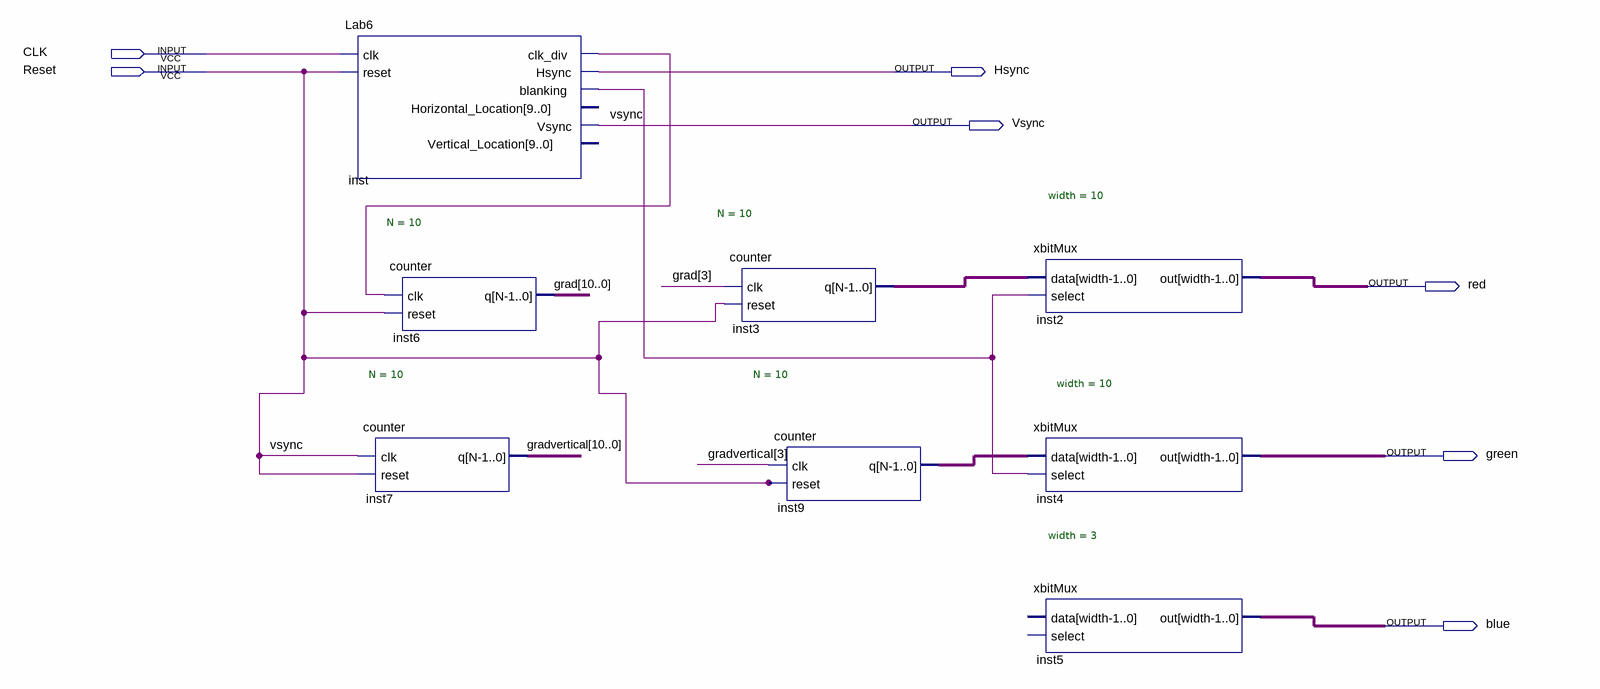
[diagram p0: schematic sheet]
// Quartus schematic rgb output.bdf as structural Verilog: 8 symbols, 7 pins
module \rgb_output  (
  input  CLK,
  input  Reset,
  output Hsync,
  output Vsync,
  output red,
  output green,
  output blue
);

  wire inst_blanking, inst_clk_div;
  wire [2:0] inst5_out;
  wire [9:0] inst2_out, inst3_q, inst4_out, inst9_q;
  wire [10:0] grad, gradvertical;

  Lab6 inst (
    .clk(CLK), .reset(Reset), .clk_div(inst_clk_div), .Hsync(Hsync), .blanking(inst_blanking), .Vsync(Reset));  // open: Horizontal_Location, Vertical_Location
  counter #(.N(10)) inst6 (.clk(inst_clk_div), .reset(Reset), .q(grad));
  counter #(.N(10)) inst7 (.clk(Reset), .reset(Reset), .q(gradvertical));
  counter #(.N(10)) inst3 (.clk(grad[3]), .reset(Reset), .q(inst3_q));
  counter #(.N(10)) inst9 (.clk(gradvertical[3]), .reset(Reset), .q(inst9_q));
  xbitMux #(.width(10)) inst2 (.data(inst3_q), .select(inst_blanking), .out(inst2_out));
  xbitMux #(.width(10)) inst4 (.data(inst9_q), .select(inst_blanking), .out(inst4_out));
  xbitMux #(.width(3)) inst5 (.out(inst5_out));  // open: data, select

  assign Vsync = Reset;
endmodule
